# EAGLE schematic FuncGenerator (EAGLE 7.6.0)
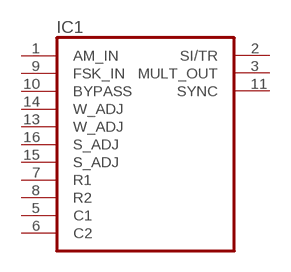
[diagram p0: schematic, sheet 1]

## Parts
IC1  XR-2206  [DIL16]
Unconnected: IC1.1(AM_IN) IC1.2(SI/TR) IC1.3(MULT_OUT) IC1.5(C1) IC1.6(C2) IC1.7(R1) IC1.8(R2) IC1.9(FSK_IN) IC1.10(BYPASS) IC1.11(SYNC) IC1.13(W_ADJ) IC1.14(W_ADJ) IC1.15(S_ADJ) IC1.16(S_ADJ)

## Power pins joined to a net without a drawn wire
GND: IC1.12(GND)
VCC: IC1.4(VCC)

## Library data of the parts
IC1 = exar:XR-2206: Monolithic FUNCTION GENERATOR; OC_FARNELL: unknown; OC_NEWARK: unknown